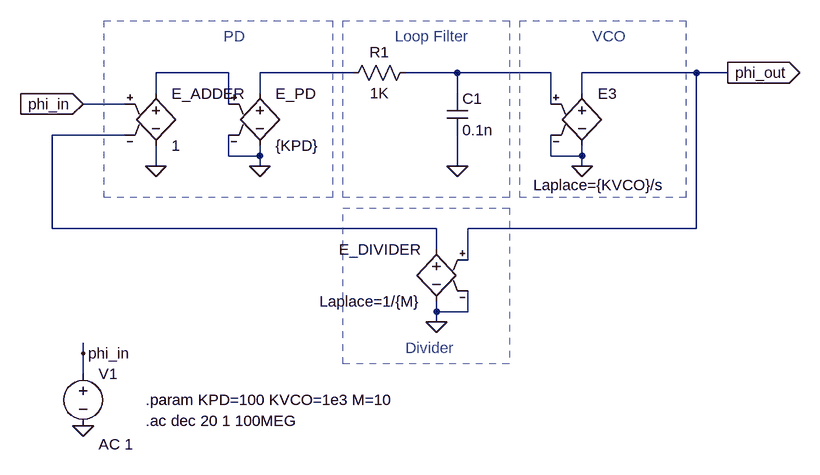
[diagram p0: schematic small_signal.asc]
small_signal.asc, the LTspice schematic file:
Version 4
SHEET 1 1188 688
WIRE 224 80 112 80
WIRE 416 80 272 80
WIRE 576 80 496 80
WIRE 720 80 576 80
WIRE 944 80 768 80
WIRE 992 80 944 80
WIRE 112 112 112 80
WIRE 272 112 272 80
WIRE 576 112 576 80
WIRE 768 112 768 80
WIRE 64 128 0 128
WIRE 224 128 224 80
WIRE 720 128 720 80
WIRE 64 176 -48 176
WIRE 224 208 224 176
WIRE 272 208 272 192
WIRE 272 208 224 208
WIRE 720 208 720 176
WIRE 768 208 768 192
WIRE 768 208 720 208
WIRE 112 224 112 192
WIRE 272 224 272 208
WIRE 576 224 576 176
WIRE 768 224 768 208
WIRE -48 320 -48 176
WIRE 544 320 -48 320
WIRE 944 320 944 80
WIRE 944 320 592 320
WIRE 544 352 544 320
WIRE 592 368 592 320
WIRE 544 448 544 432
WIRE 592 448 592 416
WIRE 592 448 544 448
WIRE 544 464 544 448
WIRE 0 512 0 496
WIRE 0 544 0 512
FLAG 0 128 phi_in
IOPIN 0 128 In
FLAG 112 224 0
FLAG 272 224 0
FLAG 576 224 0
FLAG 768 224 0
FLAG 992 80 phi_out
IOPIN 992 80 Out
FLAG 0 624 0
FLAG 0 512 phi_in
FLAG 544 464 0
SYMBOL e 112 96 R0
SYMATTR InstName E_ADDER
SYMATTR Value 1
SYMBOL e 272 96 R0
SYMATTR InstName E_PD
SYMATTR Value {KPD}
SYMBOL res 512 64 R90
WINDOW 0 0 56 VBottom 2
WINDOW 3 32 56 VTop 2
SYMATTR InstName R1
SYMATTR Value 1K
SYMBOL cap 560 112 R0
SYMATTR InstName C1
SYMATTR Value 0.1n
SYMBOL e 768 96 R0
WINDOW 3 -75 157 Left 2
SYMATTR InstName E3
SYMATTR Value Laplace={KVCO}/s
SYMATTR Value2 cache=2
SYMBOL voltage 0 528 R0
WINDOW 123 24 124 Left 2
WINDOW 39 0 0 Left 0
SYMATTR InstName V1
SYMATTR Value ""
SYMATTR Value2 AC 1
SYMBOL e 544 336 M0
SYMATTR InstName E_DIVIDER
SYMATTR Value Laplace=1/{M}
TEXT 96 584 Left 2 !.param KPD=100 KVCO=1e3 M=10
TEXT 480 24 Left 2 ;Loop Filter
TEXT 96 616 Left 2 !.ac dec 20 1 100MEG
TEXT 784 24 Left 2 ;VCO
TEXT 216 24 Left 2 ;PD
TEXT 496 504 Left 2 ;Divider
RECTANGLE Normal 656 272 400 0 2
RECTANGLE Normal 384 272 32 0 2
RECTANGLE Normal 928 272 672 0 2
RECTANGLE Normal 656 528 400 288 2

The netlist it stands for:
* small_signal.asc
E_ADDER N001 0 phi_in N004 1
E_PD N002 0 N001 0 {KPD}
R1 N003 N002 1K
C1 N003 0 0.1n
E3 phi_out 0 N003 0 Laplace={KVCO}/s cache=2
V1 phi_in 0 AC 1
E_DIVIDER N004 0 phi_out 0 Laplace=1/{M}
.param KPD=100 KVCO=1e3 M=10
* Loop Filter
.ac dec 20 1 100MEG
* VCO
* PD
* Divider
.backanno
.end